# Altium schematic sheet Power1807301255.SchDoc
size A3
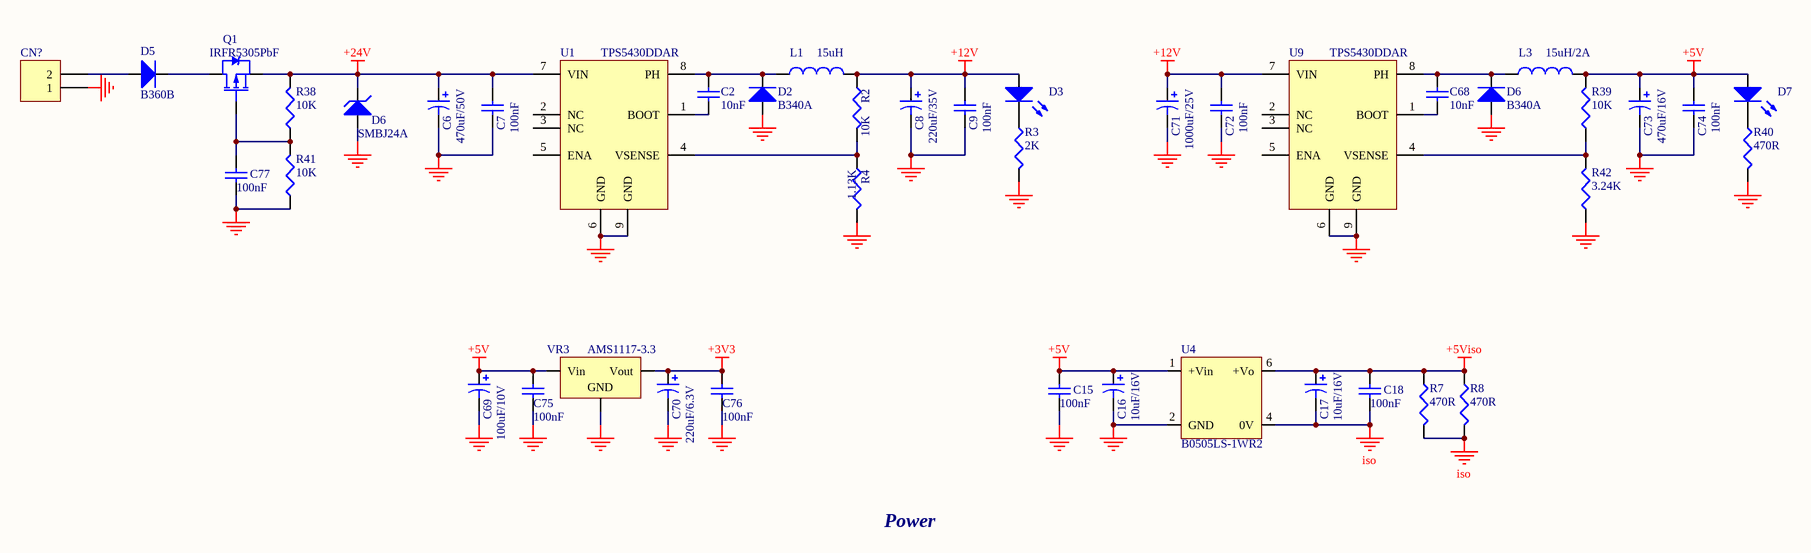
[diagram p0: Power1807301255.SchDoc]

## Parts
(Parts that share a designator on the sheet are numbered #1, #2 ... from top to bottom, then left to right.)
C2  10nF  [C0603-3]
C6  470uF/50V  [SMD-EC-F12.5]
C7  100nF  [C0603-3]
C8  220uF/35V  [SMD-EC-F10]
C9  100nF  [C0603-3]
C15  100nF  [C0603-3]
C16  10uF/16V  [CE1210]
C17  10uF/16V  [CE1210]
C18  100nF  [C0603-3]
C68  10nF  [C0603-3]
C69  100uF/10V  [CASE-B_3528]
C70  220uF/6.3V  [CASE-B_3528]
C71  1000uF/25V  [SMD-EC-F12.5]
C72  100nF  [C0603-3]
C73  470uF/16V  [SMD-EC-F8]
C74  100nF  [C0603-3]
C75  100nF  [C0603-3]
C76  100nF  [C0603-3]
C77  100nF  [C0603-3]
CN?  (no value)  [NV2-5.0]
D2  B340A  [SMA]
D3  (no value)  [LED-0805]
D5  B360B  [SMB]
D6#1  B340A  [SMA]
D6#2  SMBJ24A  [SMB]
D7  (no value)  [LED-0805]
L1  15uH  [L-SMD-8]
L3  15uH/2A  [L-SMD-8]
Q1  IRFR5305PbF  [TO-252AA(DPAK)]
R2  10K  [R0603-3]
R3  2K  [R0603-3]
R4  1.13K  [R0603-3]
R7  470R  [R0603-3]
R8  470R  [R0603-3]
R38  10K  [R0603-3]
R39  10K  [R0603-3]
R40  470R  [R0603-3]
R41  10K  [R0603-3]
R42  3.24K  [R0603-3]
U1  TPS5430DDAR  [DDA]
U4  B0505LS-1WR2  [MPS4-6.0-19.6]
U9  TPS5430DDAR  [DDA]
VR3  AMS1117-3.3  [SOT-223]

## Nets
+3V3: C70.1 C76.2 VR3.2(Vout)
+5V: C15.1 C16.1 C69.1 C73.1 C74.1 C75.2 D7.1(A) L3.2 R39.2 U4.1(+Vin) VR3.3(Vin)
+5Viso: C17.1 C18.1 R7.1 R8.1 U4.6(+Vo)
+12V: C8.1 C9.1 C71.1 C72.1 D3.1(A) L1.2 R2.1 U9.7(VIN)
+24V: C6.1 C7.1 D6#2.2(K) Q1.3(S) R38.2 U1.7(VIN)
GND: C6.2 C7.2 C8.2 C9.2 C15.2 C16.2 C69.2 C70.2 C71.2 C72.2 C73.2 C74.2 C75.1 C76.1 C77.2 CN?.1 D2.1(A) D6#1.1(A) D6#2.1(A) R3.2 R4.2 R40.2 R41.1 R42.1 U1.6(GND) U1.9(GND) U4.2(GND) U9.6(GND) U9.9(GND) VR3.1(GND)
iso: C17.2 C18.2 R7.2 R8.2 U4.4(0V)
NetC2_1: C2.1 U1.1(BOOT)
NetC2_2: C2.2 D2.2(K) L1.1 U1.8(PH)
NetC68_1: C68.1 U9.1(BOOT)
NetC68_2: C68.2 D6#1.2(K) L3.1 U9.8(PH)
NetC77_1: C77.1 Q1.1(G) R38.1 R41.2
NetCN?_2: CN?.2 D5.1(A)
NetD3_2: D3.2(K) R3.1
NetD5_2: D5.2(K) Q1.2(D)
NetD7_2: D7.2(K) R40.1
NetR2_2: R2.2 R4.1 U1.4(VSENSE)
NetR39_1: R39.1 R42.2 U9.4(VSENSE)

Not connected (* = marked no-connect by the designer): U1 2(NC) 3(NC) 5(ENA); U9 2(NC) 3(NC) 5(ENA)

## Notes on the sheet
- Power

## Library data of the parts
C2 C7 C9 C15 C18 C68 C72 C74-C77 = Cap: Capacitor; Value: 100pF; Published: 8-Jun-2000; LatestRevisionDate: 17-Jul-2002; LatestRevisionNote: Re-released for DXP Platform.; PackageReference: RAD-0.3; Publisher: Altium Limited; PackageDescription: Radial Cap, Thru-Hole; 2 Leads; 0.3 in Pin Spacing
C6 C8 C16 C17 C69 C70 C73 = Cap Pol1: Polarized Capacitor (Radial); Value: 100pF; Published: 8-Jun-2000; LatestRevisionDate: 17-Jul-2002; LatestRevisionNote: Re-released for DXP Platform.; PackageReference: RB7.6-15; Publisher: Altium Limited; PackageDescription: Polarized Capacitor (Radial); 2 Leads
C71 = Cap Pol1: Polarized Capacitor (Axial); Value: 100pF; Published: 8-Jun-2000; LatestRevisionDate: 17-Jul-2002; LatestRevisionNote: Re-released for DXP Platform.; PackageReference: POLAR0.8; Publisher: Altium Limited; PackageDescription: Polarized Capacitor; 2 Leads
CN? = Header 2: Header, 2-Pin; LatestRevisionDate: 17-Jul-2002; LatestRevisionNote: Re-released for DXP Platform.; Publisher: Altium Limited
D2 D5 D6#1 = Diode: Default Diode; Published: 8-Jun-2000; LatestRevisionDate: 17-Jul-2002; LatestRevisionNote: Re-released for DXP Platform.; PackageVersion: Sep-1996; PackageReference: SMC; Publisher: Altium Limited; PackageDescription: DO-214-AB/SMC; 2 C-Bend Leads; Body 7.9 x 5.9 mm, inc. leads (LxW); Code_JEDEC: DO-214-AB
D3 D7 = LED0: Typical INFRARED GaAs LED; Published: 8-Jun-2000; LatestRevisionDate: 08-Jul-2005; LatestRevisionNote: Mech Layer 1 removed.; PackageReference: LED-0; Publisher: Altium Limited; PackageDescription: LED; 2 Leads
D6#2 = D Zener: Zener Diode; Published: 8-Jun-2000; LatestRevisionDate: 17-Jul-2002; LatestRevisionNote: Re-released for DXP Platform.; PackageReference: DIODE-0.7; Publisher: Altium Limited; PackageDescription: Diode, Thru-Hole; 2 Leads; 0.7 in Pin Spacing
L1 L3 = Inductor: Code_IEC: 1005; Value: 10mH; Published: 8-Jun-2000; LatestRevisionDate: 29-May-2009; LatestRevisionNote: IPC-7351 Footprint Added.; PackageReference: 0402-A; Publisher: Altium Limited; PackageDescription: Chip Inductor; Code_JEITA: 0402
Q1 = PMOS-2: P-Channel Power MOSFET; Note: Pin 4 not drawn and electrically connected to Pin 2.; Published: 8-Jun-2000; LatestRevisionDate: 17-Jul-2002; LatestRevisionNote: Re-released for DXP Platform.; DatasheetVersion: PD-9.390D; PackageVersion: Feb-1997; PackageReference: TO-220AB; Publisher: Altium Limited; PackageDescription: TO, Thru-Hole, Vertical, Heatsink Mounted; 3 In-Line Leads; Pitch 2.54 mm; ComponentLink1Description: Manufacturer Link; ComponentLink1URL: http://www.irf.com/
R2-R4 R7 R8 R38-R42 = Res3: Resistor; Value: 1K; Published: 8-Jun-2000; LatestRevisionDate: 29-May-2009; LatestRevisionNote: IPC-7351 Footprint Added.; PackageReference: J1-0603; Publisher: Altium Limited; PackageDescription: Chip Resistor
U1 U9 = TPS5430: TPS543x 3-A, Wide Input Range, Step-Down Converter
U4 = BxxxxLS-1WR2: B_LS-1WR2 Series
VR3 = Volt Reg 2: Voltage Regulator; Published: 24-Mar-1999; LatestRevisionDate: 29-May-2009; LatestRevisionNote: IPC-7351 Footprint Added.; PackageReference: D2PAK; Publisher: Altium Limited; PackageDescription: 3-Pin Transistor Outline Package 2.54 mm Pitch, 15.1 mm Lead Span